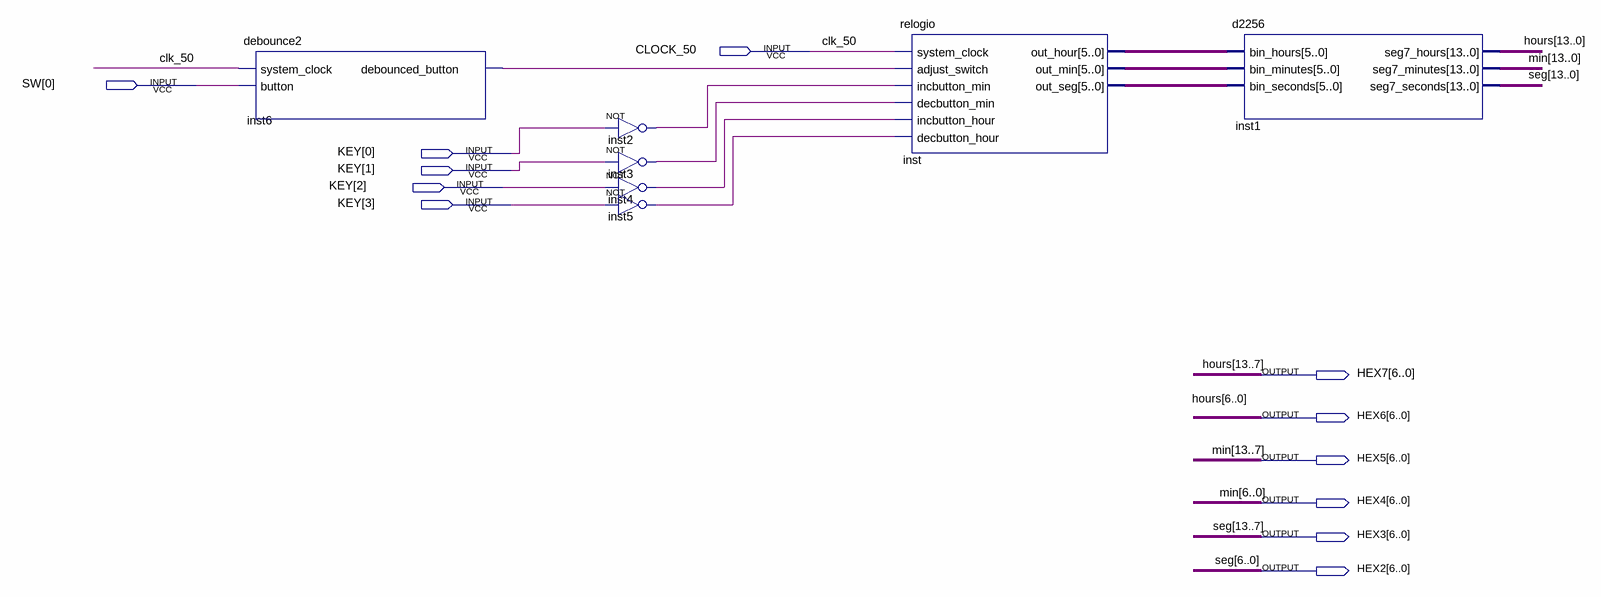
[diagram p0: schematic sheet]
// Quartus schematic relogio_test.bdf as structural Verilog: 7 symbols, 12 pins
module relogio_test (
  input  CLOCK_50,
  input  [0:0] SW,
  input  [3:0] KEY,
  output [6:0] HEX7,
  output [6:0] HEX6,
  output [6:0] HEX5,
  output [6:0] HEX4,
  output [6:0] HEX3,
  output [6:0] HEX2
);

  wire inst2_out, inst3_out, inst4_out, inst5_out, inst6_debounced_button;
  wire [5:0] inst_out_hour, inst_out_min, inst_out_seg;

  debounce2 inst6 (.system_clock(CLOCK_50), .button(SW[0]), .debounced_button(inst6_debounced_button));
  not inst2 (inst2_out, KEY[0]);
  not inst3 (inst3_out, KEY[1]);
  not inst4 (inst4_out, KEY[2]);
  not inst5 (inst5_out, KEY[3]);
  relogio inst (
    .system_clock(CLOCK_50), .adjust_switch(inst6_debounced_button), .incbutton_min(inst2_out),
    .decbutton_min(inst3_out), .incbutton_hour(inst4_out), .decbutton_hour(inst5_out),
    .out_hour(inst_out_hour), .out_min(inst_out_min), .out_seg(inst_out_seg));
  d2256 inst1 (
    .bin_hours(inst_out_hour), .bin_minutes(inst_out_min), .bin_seconds(inst_out_seg),
    .seg7_hours({HEX7, HEX6}), .seg7_minutes({HEX5, HEX4}), .seg7_seconds({HEX3, HEX2}));

  // Other names for the same wires on the sheet: clk_50 = CLOCK_50; hours[13:0] = {HEX7, HEX6};
  //   min[13:0] = {HEX5, HEX4}; seg[13:0] = {HEX3, HEX2}
endmodule
